# Altium schematic sheet CP2102.SchDoc
size A4
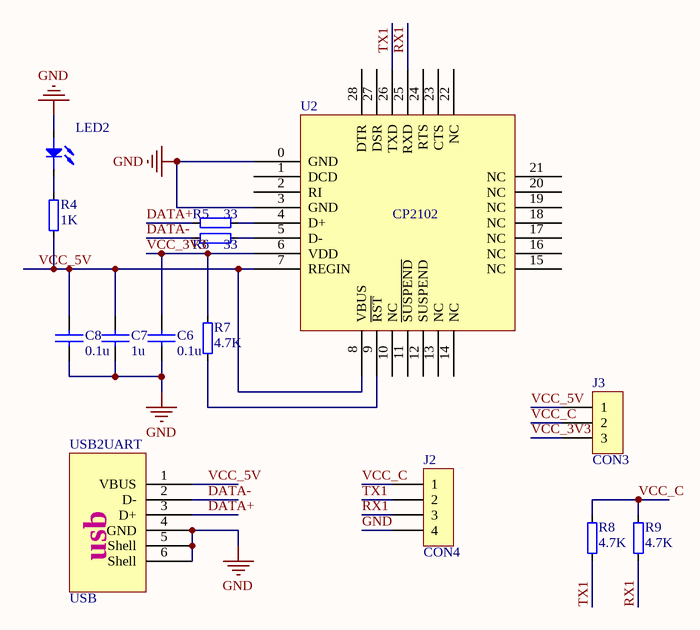
[diagram p0: CP2102.SchDoc]

## Parts
C6  0.1u  [C0603]
C7  1u  [C0603]
C8  0.1u  [C0603]
J2  CON4  [HDR1X4]
J3  CON3  [HDR1X3]
LED2  (no value)  [LED0805]
R4  1K  [R0603]
R5  33  [R0603]
R6  33  [R0603]
R7  4.7K  [R0603]
R8  4.7K  [R0603]
R9  4.7K  [R0603]
U2  CP2102  [CP2102]
USB2UART  USB  [USB-B]

## Nets
GND: C6.2 C7.2 C8.2 J2.4 LED2.1 U2.0(GND) U2.3(GND) USB2UART.4(GND) USB2UART.5(Shell) USB2UART.6(Shell)
DATA+: R5.1 USB2UART.3(D+)
DATA-: R6.1 USB2UART.2(D-)
RX1: J2.3 R9.1 U2.25(RXD)
TX1: J2.2 R8.1 U2.26(TXD)
VCC_3V3: C6.1 J3.3 R7.2 U2.6(VDD)
VCC_5V: C7.1 C8.1 J3.1 R4.1 U2.7(REGIN) U2.8(VBUS) USB2UART.1(VBUS)
VCC_C: J2.1 J3.2 R8.2 R9.2
NetLED2_2: LED2.2 R4.2
NetR5_2: R5.2 U2.4(D+)
NetR6_2: R6.2 U2.5(D-)
NetR7_1: R7.1 U2.9(~{RST})

Not connected (* = marked no-connect by the designer): U2 1(DCD) 2(RI) 10(NC) 11(~{SUSPEND}) 12(SUSPEND) 13(NC) 14(NC) 15(NC) 16(NC) 17(NC) 18(NC) 19(NC) 20(NC) 21(NC) 22(NC) 23(CTS) 24(RTS) 27(DSR) 28(DTR)

## Notes on the sheet
- (in symbol USB) usb

## Library data of the parts
C6-C8 = CAP: Part Field 1: CAP X7R 100NF 10% 50V 0805; Part Field 2: AAPL; Part Field 3: 8124-10446-12
J2 = CON4: Connector
J3 = CON3: Connector
LED2 = LED
R4-R6 = res
R7-R9 = RES